# EasyEDA schematic LR3.json
TITLE: Sheet_2; REV: 1.0; Date: 2022-02-28; Sheet: 1/1; Drawn By: ИВТ-31; Company: Your Company
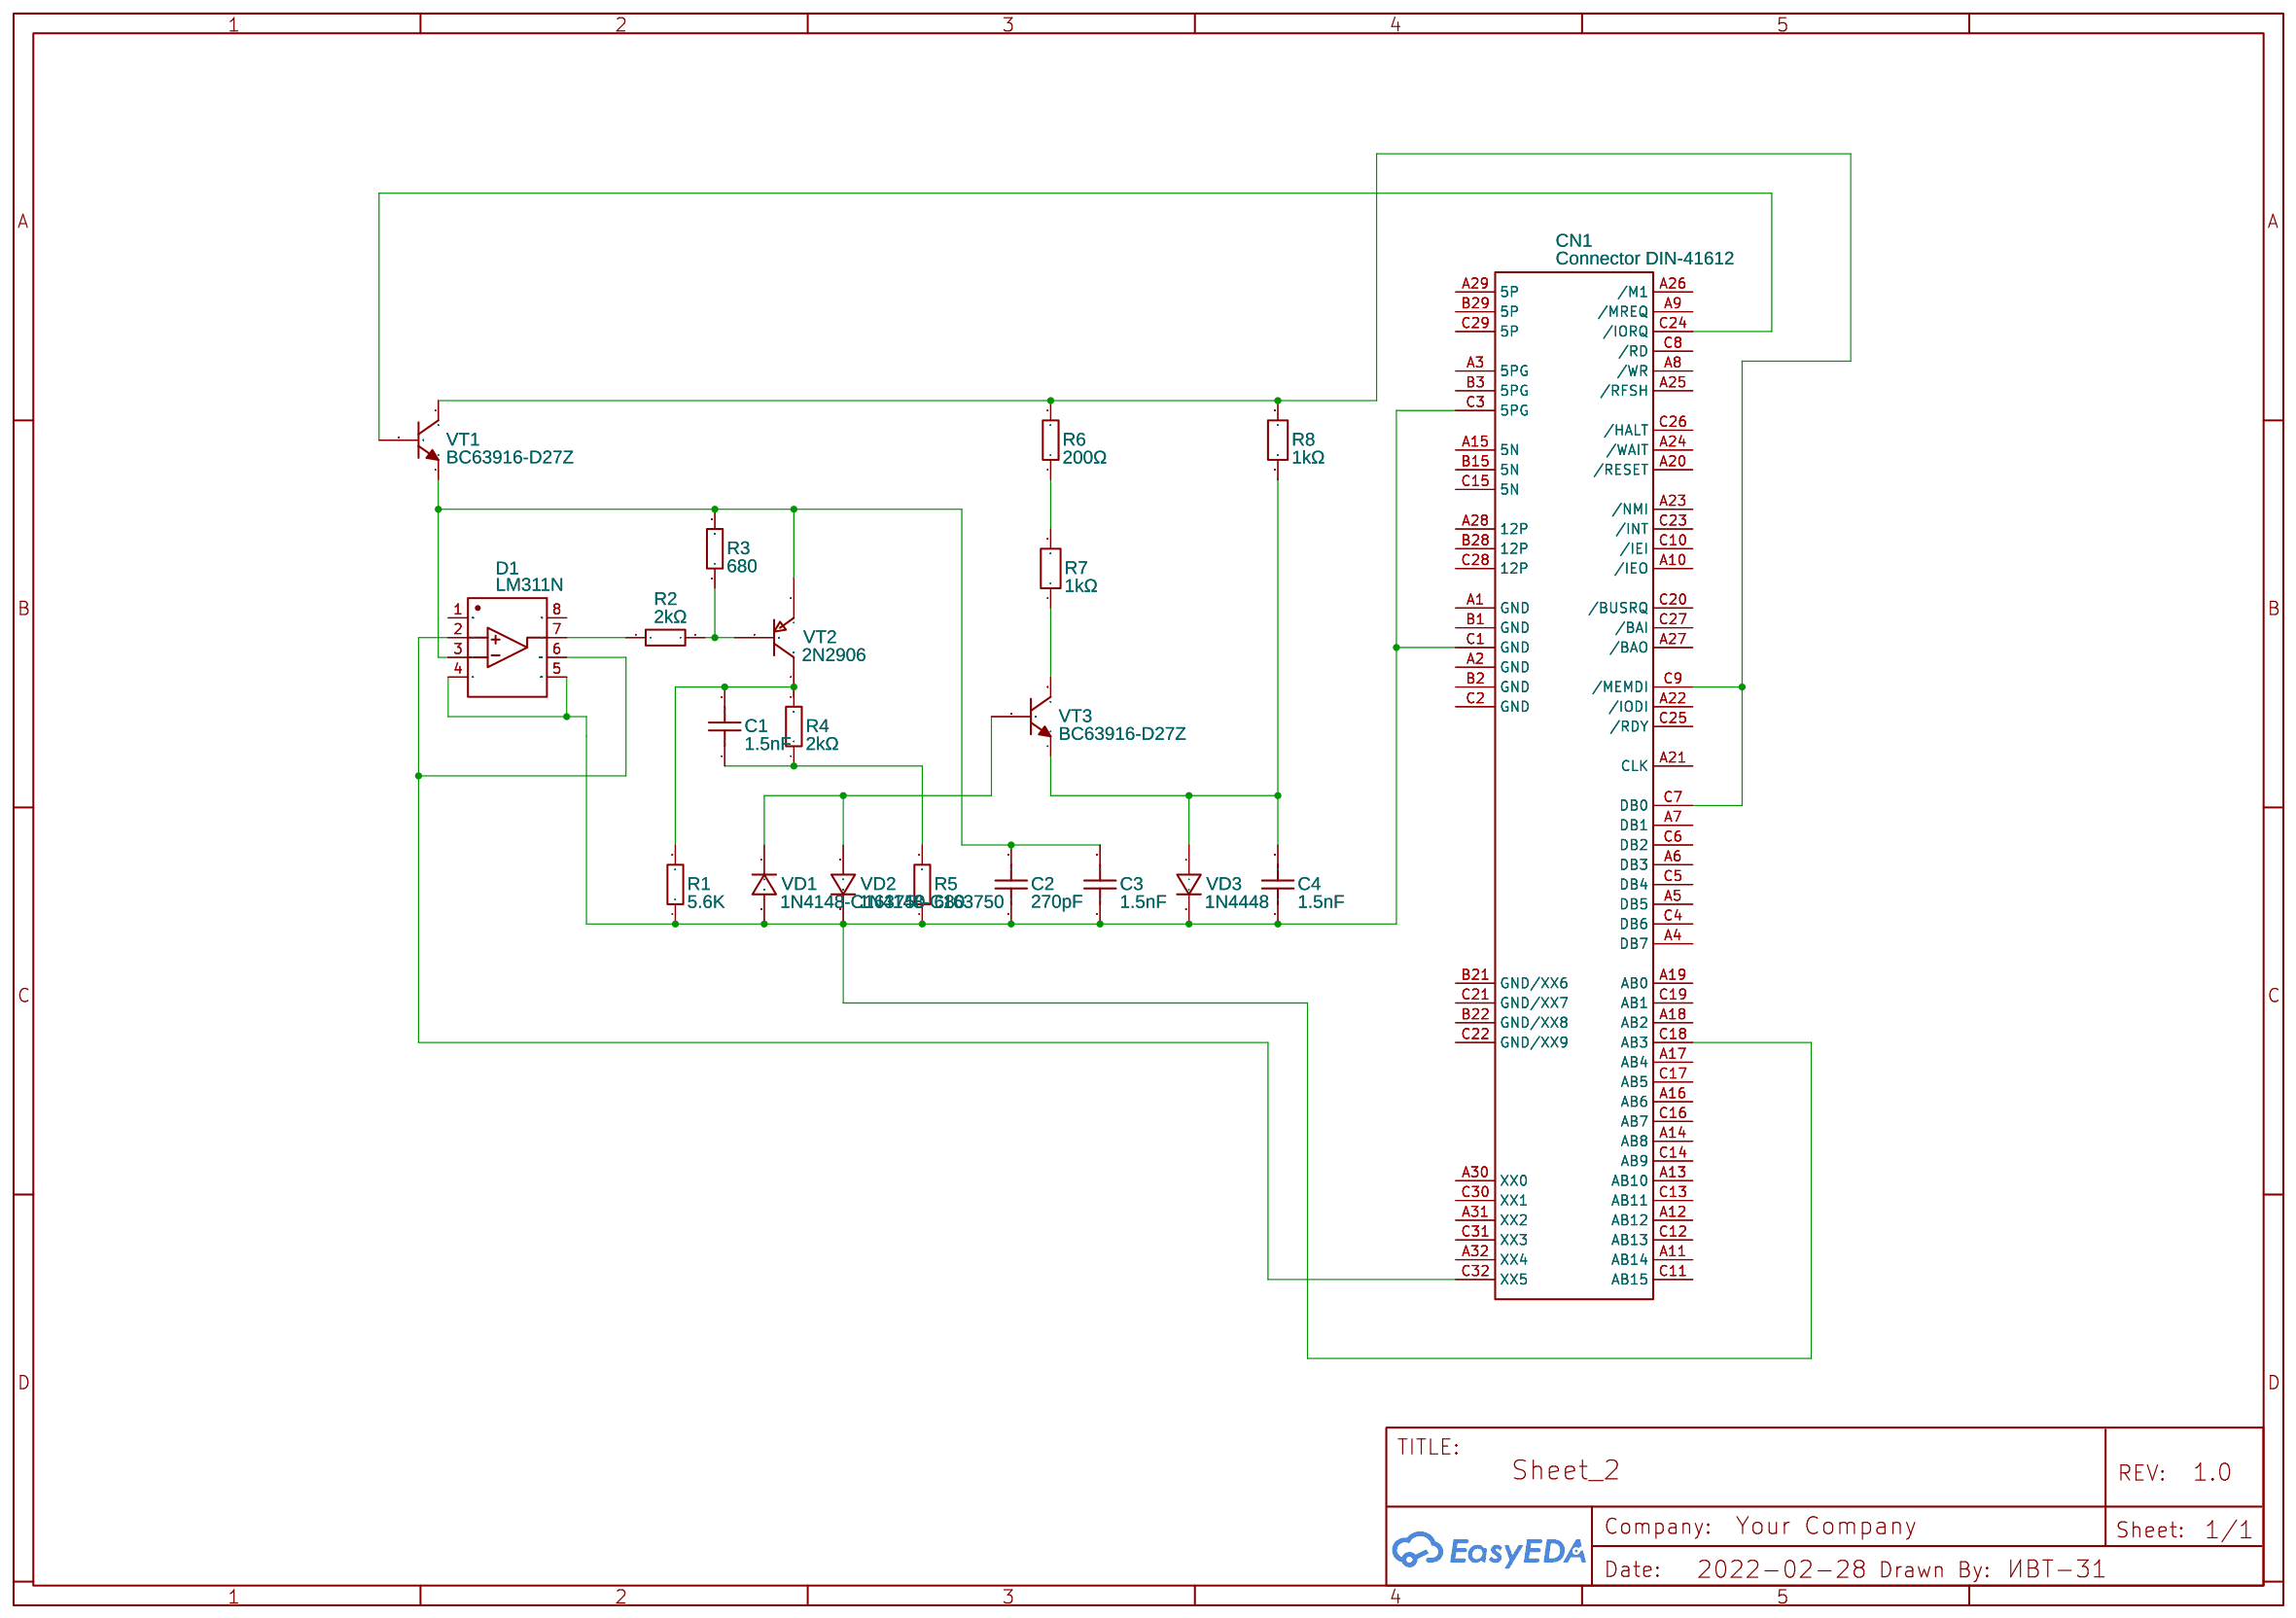
[diagram p0: schematic sheet]

## Parts
C1  1.5nF  [CAP-TH_L7.0-W5.0-P5.08-D1.0]
C2  270pF  [CAP-TH_L5.0-W2.5-P5.08-D0.7]
C3  1.5nF  [CAP-TH_L7.0-W5.0-P5.08-D1.0]
C4  1.5nF  [CAP-TH_L7.0-W5.0-P5.08-D1.0]
CN1  Connector DIN-41612  [CONNECTOR DIN-42612 A-B-C MALE]
D1  LM311N  [DIP-8_L9.8-W6.6-P2.54-LS7.6-BL]
R1  5.6K  [R0402]
R2  2kΩ  [R0603]
R3  680  [R0402]
R4  2kΩ  [R0603]
R5  680  [R0402]
R6  200Ω  [R1206]
R7  1kΩ  [R0805]
R8  1kΩ  [R0805]
VD1  1N4148-C163750  [DO-35_BD2.0-L4.2-P8.20-D0.5-RD]
VD2  1N4148-C163750  [DO-35_BD2.0-L4.2-P8.20-D0.5-RD]
VD3  1N4448  [DO-35_BD2.0-L4.2-P8.20-D0.5-R-RD]
VT1  BC63916-D27Z  [TO-92-3_L4.9-W3.7-P2.54-L]
VT2  2N2906  [22-03]
VT3  BC63916-D27Z  [TO-92-3_L4.9-W3.7-P2.54-L]

## Library data of the parts
C1 C3 C4 = CK45-B3AD152KYVNA: Supplier: LCSC; Supplier Part: C342400; Manufacturer: TDK; Contributor: LCSC; JLCPCB Part Class: Extended Part
C2 = CC1H271KC74DB44B10MN: Supplier: LCSC; Supplier Part: C254100; Manufacturer: Dersonic; Contributor: LCSC; JLCPCB Part Class: Extended Part
CN1 = Connector DIN-41612: Manufacturer: Robotron; Manufacturer Part: EFS87; Contributor: schorcht
D1 = LM311N: Supplier: LCSC; Supplier Part: C434572; Manufacturer: HGSEMI; Contributor: LCSC; JLCPCB Part Class: Extended Part
R1 = RC0402JR-075K6L: Supplier: LCSC; Manufacturer: YAGEO; Supplier Part: C137856; JLCPCB Part Class: Extended Part; Resistance: 5.6kΩ
R2 R4 = 0603WAF2001T5E: Supplier: LCSC; Manufacturer: UniOhm; Supplier Part: C22975; Resistance (Ohms): 2K; JLCPCB Part Class: Basic Part
R3 R5 = RC0402JR-07680RL: Supplier: LCSC; Manufacturer: YAGEO; Supplier Part: C137849; JLCPCB Part Class: Extended Part; Resistance: 680Ω
R6 = RTT06201JTP: Supplier: LCSC; Manufacturer: RALEC; Supplier Part: C104688; Resistance (Ohms): 200; JLCPCB Part Class: Extended Part
R7 R8 = AS05W2J0102T5E: Supplier: LCSC; Supplier Part: C560481; Manufacturer: UNI-ROYAL(Uniroyal Elec); Contributor: LCSC; JLCPCB Part Class: Extended Part
VD1 VD2 = 1N4148-C163750: Supplier Part: C163750; Supplier: LCSC; Manufacturer: FMS; Manufacturer Part: 1N4148; Contributor: LCSC; JLCPCB Part Class: Extended Part
VD3 = 1N4448: Supplier: LCSC; Manufacturer: SEMTECH; Supplier Part: C54037; Contributor: 官方封装库; JLCPCB Part Class: Extended Part
VT1 VT3 = BC63916-D27Z: Supplier: LCSC; Supplier Part: C900812; Manufacturer: ON(安森美); Contributor: LCSC; JLCPCB Part Class: Extended Part
VT2 = 2N2906: General Purpose Transistor PNP Silicon

## Nets
Net-(C1-1): C1.1 R4.1 R5.2
Net-(C1-2): C1.2 R1.2 R4.2
Net-(C2-1): C2.1 C3.1 C4.1 CN1.C1(GND) CN1.C3(5PG) CN1.C18(AB3) D1.4(VEE) D1.5(BALANCE) R1.1 R5.1 VD1.2 VD2.1 VD3.2(K)
Net-(C2-2): C2.2 C3.2 D1.3(IN-) R3.2 VT1.1(E) VT2.1(E)
Net-(C4-2): C4.2 R8.1 VD3.1(A) VT3.1(E)
Net-(CN1-C7): CN1.C7(DB0) CN1.C9(/MEMDI) R6.2 R8.2 VT1.2(C)
Net-(CN1-C24): CN1.C24(/IORQ) VT1.3(B)
Net-(CN1-C32): CN1.C32(XX5) D1.2(IN+) D1.6(BALANCE/STROBE)
Net-(D1-7): D1.7(OUT) R2.1
Net-(R2-2): R2.2 R3.1 VT2.2(B)
Net-(R6-1): R6.1 R7.2
Net-(R7-1): R7.1 VT3.2(C)
Net-(VD1-1): VD1.1 VD2.2 VT3.3(B)

Not connected (* = marked no-connect by the designer): CN1 A1(GND) A2(GND) A3(5PG) A4(DB7) A5(DB5) A6(DB3) A7(DB1) A8(/WR) A9(/MREQ) A10(/IEO) A11(AB14) A12(AB12) A13(AB10) A14(AB8) A15(5N) A16(AB6) A17(AB4) A18(AB2) A19(AB0) A20(/RESET) A21(CLK) A22(/IODI) A23(/NMI) A24(/WAIT) A25(/RFSH) A26(/M1) A27(/BAO) A28(12P) A29(5P) A30(XX0) A31(XX2) A32(XX4) B1(GND) B2(GND) B3(5PG) B15(5N) B21(GND/XX6) B22(GND/XX8) B28(12P) B29(5P) C2(GND) C4(DB6) C5(DB4) C6(DB2) C8(/RD) C10(/IEI) C11(AB15) C12(AB13) C13(AB11) C14(AB9) C15(5N) C16(AB7) C17(AB5) C19(AB1) C20(/BUSRQ) C21(GND/XX7) C22(GND/XX9) C23(/INT) C25(/RDY) C26(/HALT) C27(/BAI) C28(12P) C29(5P) C30(XX1) C31(XX3); D1 1(GND) 8(VCC); VT2 3(C)
